# EAGLE design Adafruit PiCowbell CAN Bus (EAGLE 9.6.2)
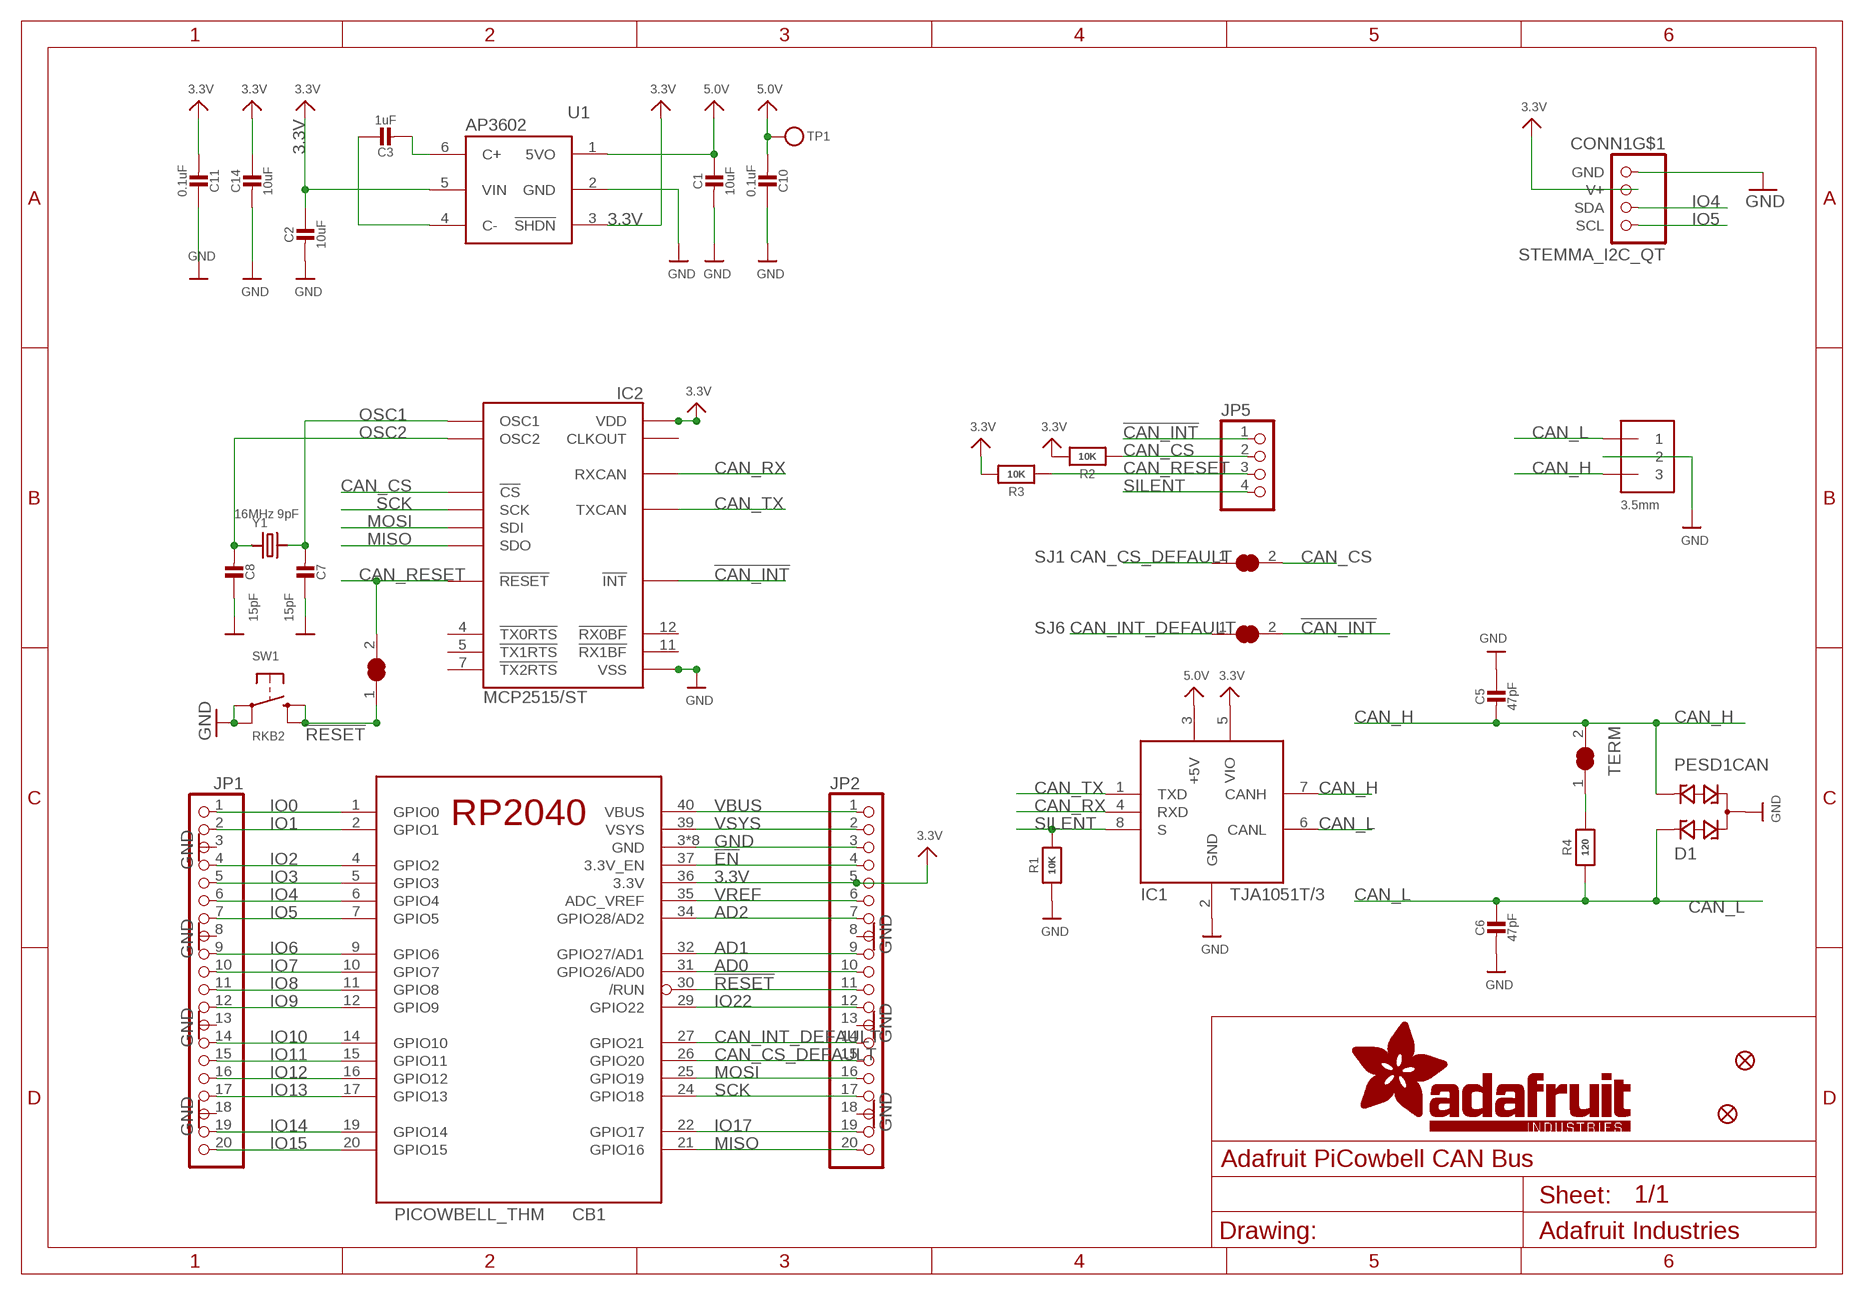
[diagram p0: schematic, sheet 1]

## Parts
C1  10uF  CAP_CERAMIC0805-NOOUTLINE  [0805-NO]
C2  10uF  CAP_CERAMIC0805-NOOUTLINE  [0805-NO]
C3  1uF  CAP_CERAMIC0805-NOOUTLINE  [0805-NO]
C5  47pF  CAP_CERAMIC0603_NO  [0603-NO]
C6  47pF  CAP_CERAMIC0603_NO  [0603-NO]
C7  15pF  CAP_CERAMIC0603_NO  [0603-NO]
C8  15pF  CAP_CERAMIC0603_NO  [0603-NO]
C10  0.1uF  CAP_CERAMIC0603_NO  [0603-NO]
C11  0.1uF  CAP_CERAMIC0603_NO  [0603-NO]
C14  10uF  CAP_CERAMIC0805-NOOUTLINE  [0805-NO]
CAN  3.5mm  TERMBLOCK_1X3  [TERMBLOCK_1X3-3.5MM]
CB1  PICOWBELL_THM  [PICOWBELL_THM]
CONN1  STEMMA_I2C_QT  [JST_SH4]
D1  PESD1CAN  [SOT23]
FID1  FIDUCIAL_1MM  [FIDUCIAL_1MM]
FID2  FIDUCIAL_1MM  [FIDUCIAL_1MM]
IC1  TJA1051T/3  CAN_TRANSCIEVER_TCAN1051V  [SOIC8_150MIL]
IC2  MCP2515/ST  [SSOP20]
JP1  HEADER-1X20_70MIL  [1X20_ROUND_70MIL]
JP2  HEADER-1X20_70MIL  [1X20_ROUND_70MIL]
JP5  HEADER-1X4ROUND  [1X04_ROUND]
R1  10K  RESISTOR_0603_NOOUT  [0603-NO]
R2  10K  RESISTOR_0603_NOOUT  [0603-NO]
R3  10K  RESISTOR_0603_NOOUT  [0603-NO]
R4  120  RESISTOR_0603_NOOUT  [0603-NO]
SJ1  SOLDERJUMPER_CLOSED  [SOLDERJUMPER_CLOSEDWIRE]
SJ5  SOLDERJUMPER_CLOSED  [SOLDERJUMPER_CLOSEDWIRE]
SJ6  SOLDERJUMPER_CLOSED  [SOLDERJUMPER_CLOSEDWIRE]
SW1  RKB2  SWITCH_TACT_SMT_RKB2  [BTN_RKB2_4.6X2.8]
TERM  SOLDERJUMPER_CLOSED  [SOLDERJUMPER_CLOSEDWIRE]
TP1  TESTPOINTROUND1.5MM  [TESTPOINT_ROUND_1.5MM]
U1  AP3602  [SOT23-6]
Y1  16MHz 9pF  CRYSTAL3.2X2.5  [CRYSTAL_3.2X2.5]

## Nets
3.3V: C2.1 C11.2 C14.1 CB1.36(3.3V) CONN1.2(V+) IC1.5(VIO) IC2.20(VDD) JP2.5 R2.2 R3.2 U1.3(!SHDN) U1.5(VIN)
5.0V: C1.1 C10.2 IC1.3(+5V) TP1.P$1 U1.1(5VO)
!CAN_INT: IC2.13(!INT) JP5.1 SJ6.2
!EN: CB1.37(3.3V_EN) JP2.4
!RESET: CB1.30(/RUN) JP2.11 SJ5.1 SW1.B'(S1) SW1.B(S)
AD0: CB1.31(GPIO26/AD0) JP2.10
AD1: CB1.32(GPIO27/AD1) JP2.9
AD2: CB1.34(GPIO28/AD2) JP2.7
CAN_CS: IC2.18(!CS) JP5.2 R2.1 SJ1.2
CAN_CS_DEFAULT: CB1.26(GPIO20) JP2.15 SJ1.1
CAN_H: C5.2 CAN.3 D1.2 IC1.7(CANH) TERM.2
CAN_INT_DEFAULT: CB1.27(GPIO21) JP2.14 SJ6.1
CAN_L: C6.1 CAN.1 D1.1 IC1.6(CANL) R4.1
CAN_RESET: IC2.19(!RESET) JP5.3 R3.1 SJ5.2
CAN_RX: IC1.4(RXD) IC2.2(RXCAN)
CAN_TX: IC1.1(TXD) IC2.1(TXCAN)
GND: C1.2 C2.2 C5.1 C6.2 C7.1 C8.1 C10.1 C11.1 C14.2 CAN.2 CB1.3(GND) CB1.8(GND) CB1.13(GND) CB1.18(GND) CB1.23(GND) CB1.28(GND) CB1.33(GND) CB1.38(GND) CONN1.1(GND) D1.3 IC1.2(GND) IC2.10(VSS) JP1.3 JP1.8 JP1.13 JP1.18 JP2.3 JP2.8 JP2.13 JP2.18 R1.1 SW1.A'(P1) SW1.A(P) U1.2(GND)
IO0: CB1.1(GPIO0) JP1.1
IO1: CB1.2(GPIO1) JP1.2
IO2: CB1.4(GPIO2) JP1.4
IO3: CB1.5(GPIO3) JP1.5
IO4: CB1.6(GPIO4) CONN1.3(SDA) JP1.6
IO5: CB1.7(GPIO5) CONN1.4(SCL) JP1.7
IO6: CB1.9(GPIO6) JP1.9
IO7: CB1.10(GPIO7) JP1.10
IO8: CB1.11(GPIO8) JP1.11
IO9: CB1.12(GPIO9) JP1.12
IO10: CB1.14(GPIO10) JP1.14
IO11: CB1.15(GPIO11) JP1.15
IO12: CB1.16(GPIO12) JP1.16
IO13: CB1.17(GPIO13) JP1.17
IO14: CB1.19(GPIO14) JP1.19
IO15: CB1.20(GPIO15) JP1.20
IO17: CB1.22(GPIO17) JP2.19
IO22: CB1.29(GPIO22) JP2.12
MISO: CB1.21(GPIO16) IC2.17(SDO) JP2.20
MOSI: CB1.25(GPIO19) IC2.16(SDI) JP2.16
N$1: C3.2 U1.6(C+)
N$2: C3.1 U1.4(C-)
N$3: R4.2 TERM.1
OSC1: C7.2 IC2.9(OSC1) Y1.2
OSC2: C8.2 IC2.8(OSC2) Y1.1
SCK: CB1.24(GPIO18) IC2.14(SCK) JP2.17
SILENT: IC1.8(S) JP5.4 R1.2
VBUS: CB1.40(VBUS) JP2.1
VREF: CB1.35(ADC_VREF) JP2.6
VSYS: CB1.39(VSYS) JP2.2
Unconnected: CONN1.MT1(MT) CONN1.MT2(MT) IC2.3(CLKOUT) IC2.4(!TX0RTS) IC2.5(!TX1RTS) IC2.7(!TX2RTS) IC2.11(!RX1BF) IC2.12(!RX0BF)

## Library data of the parts
C1-C3 C5-C8 C10 C11 C14 = microbuilder:CAP_CERAMIC: Ceramic Capacitors For new designs, use the packages preceded by an '_' character since they are more reliable: The following footprints should be used on most boards: _0402 - Standard footprint for regular board layouts _0603 - Standard footprint for regular board layouts _0805 - Standard footprint for regular board layouts _1206 - Standard footprint for regular board layouts For extremely tight-pitch boards where space is at a premium, the following 'micro-pitch' footprints can be used (smaller pads, no silkscreen outline, etc.): _0402MP - Micro-pitch footprint for very dense/compact boards _0603MP - Micro-pitch footprint for very dense/compact boards _0805MP - Micro-pitch footprint for very dense/compact boards _1206MP - Micro-pitch footprint for very dense/compact boards
CAN = adafruit_electromech:TERMBLOCK_1X3: 3.5mm Terminal block http://www.ladyada.net/library/pcb/eaglelibrary.html
CB1 = adafruit_micro:PICOWBELL
CONN1 = adafruit_electromech:STEMMA_I2C; LCSC: C2845363
D1 = diode:PESD1CAN: CAN bus ESD protection diode Source: http://www.nxp.com/documents/data_sheet/PESD1CAN.pdf
FID1 FID2 = microbuilder:FIDUCIAL: Fiducial Alignment Points Various fiducial points for machine vision alignment.; BOM: EXCLUDE
IC1 = microbuilder:CAN_TRANSCIEVER
IC2 = microbuilder:MCP2515
JP1 JP2 = adafruit_electromech:HEADER-1X20
JP5 = microbuilder:HEADER-1X4: PIN HEADER
R1-R4 = microbuilder:RESISTOR: Resistors For new designs, use the packages preceded by an '_' character since they are more reliable: The following footprints should be used on most boards: _0402 - Standard footprint for regular board layouts _0603 - Standard footprint for regular board layouts _0805 - Standard footprint for regular board layouts _1206 - Standard footprint for regular board layouts For extremely tight-pitch boards where space is at a premium, the following 'micro-pitch' footprints can be used (smaller pads, no silkscreen outline, etc.): _0402MP - Micro-pitch footprint for very dense/compact boards _0603MP - Micro-pitch footprint for very dense/compact boards _0805MP - Micro-pitch footprint for very dense/compact boards _1206MP - Micro-pitch footprint for very dense/compact boards
SJ1 SJ5 SJ6 TERM = microbuilder:SOLDERJUMPER_CLOSED: Solder Jumper - Closed These solder jumpers are closed by default CLOSEDWIRE - 10 mil trace between pads that can be cut and resoldered later CLOSEDPERM - 63 mil trace between pads for a permanent connection (used to 'bridge' two signals, a shameless hack for Eagle). Can double as a test point as well (no cream layer)
SW1 = adafruit_electromech:SWITCH_TACT_SMT: SMT Tact Switches RKB2 https://www.digikey.com/short/m027prz5
TP1 = microbuilder:TESTPOINT: Test Point Various test points for characterisation and PCB testing TESTPOINT_SMT - Compact Surface Mount Test Point [Digikey: 5016KTR-ND]
U1 = microbuilder:AP3602
Y1 = microbuilder:CRYSTAL: Crystals HC49UP - Surface Mount Crystal 4.0MHz 18pF +/-30ppm Surface Mount Crystal [Digikey: 535-9857-1-ND] 12.0 MHz Surface Mount Crystal [Digikey: 535-9869-6-ND] 25.0 MHz Surface Mount Crystal [Digikey: 535-9078-1-ND] 2.5 x 2.0mm - MEMs SMT Crystal 16.0 MHz 10pF 20ppm 2.5 x 2.0mm Crystal [Digikey -40-85°C: 535-10923-1-ND] 3.2 x 2.5mm - MEMs SMT Crystal 12.0 MHz 8pF 15ppm 3.2 x 2.5mm Crystal [Digikey: -10-70°C: 644-1047-1-ND -40-125°C: 644-1128-1-ND] 40~85°C cheaper: 644-1173-6-ND 16.0 MHz 8pF 15ppm 3.2 x 2.5mm Crystal [Digikey: -10-70°C: 644-1049-1-ND -40-125°C: 644-1129-2-ND]-40~85°C cheaper: 644-1175-6-ND 16.0 MHz 10pF 10ppm 3.2 x 2.5mm Crystal [Digikey: 644-1100-1-ND] 27.12 MHz 18pF 30ppm 3.2 x 2.5mm Crystal [Digikey: 887-1424-1-ND] 27.12MHz 10pF 10ppm 3.2 x 2.5mm Crystal [Digikey: 887-1329-1-ND] 4.9 x 1.8mm - MEMs SMT Crystal 32.768 KHz 12.5pF 20ppm 4.9 x 1.8mm Crystal [Digikey: SE2415CT-ND] 8.0 x 3.8mm - Surface Mount Crystal 32.768kHz 12.5pF 20ppm -40°C-85°C [Digikey: 535-9166-2-ND] Cylinder 32.768KHz Cylinder Crystal (2x6mm body) [Ex. Digikey: 300-8341-2-ND]

## Board
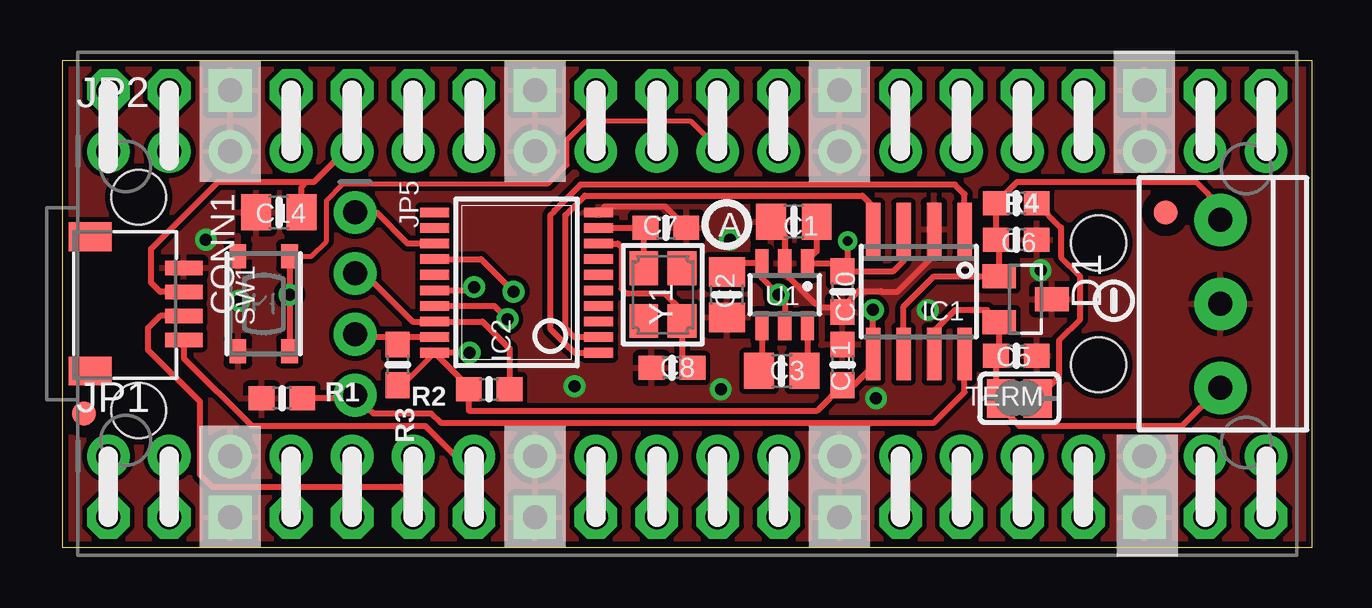
[diagram p1: board, top side]
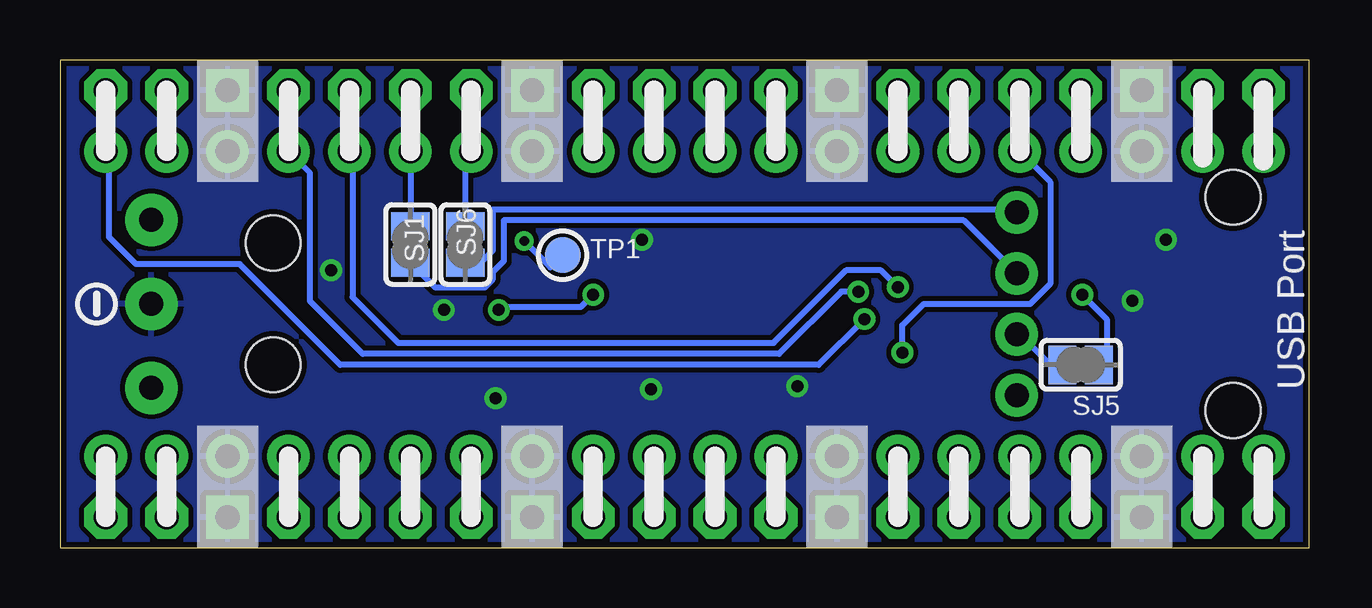
[diagram p2: board, bottom side, seen from below]

Size 52.07 x 20.32 mm. Coordinates in mm from the lower left corner, seen from the top.
Outline: 0,0 0,20.32 52.07,20.32 52.07,0 0,0
Copper layers (1*16): Top 0.035mm / dielectric 1.5mm / Bottom 0.035mm
Design rules "adafruit": minimum track width 8mil, minimum drill 15.5mil, track to track 8mil, track to pad 8mil, pad to pad 8mil, via to via 8mil, smd to smd 8mil, copper to edge 10mil, drill to drill 8mil, minimum pad ring 10mil, minimum via ring 8mil, stop-mask expansion 2mil, vias tented up to drill 20mil, thermal gap 10mil
Holes 2.29 mm at 3.17,14.61 3.17,5.71 43.18,12.7 43.18,7.62

### Footprints (pad centres in the part's own frame; a part is rotated, then mirrored left to right if it is on the bottom)
0805-NO = smd 1.24 x 1.5: 1 -0.95,0; 2 0.95,0
0603-NO = smd 1.075 x 1: 1 -0.85,0; 2 0.85,0
TERMBLOCK_1X3-3.5MM = drill 1 pad 2.184: 1 3.5,0; 2 0,0; 3 -3.5,0
PICOWBELL_THM = drill 1 pad 1.778 octagon: 1 1.27,0; 2 3.81,0; 4 8.89,0; 5 11.43,0; 6 13.97,0; 7 16.51,0; 9 21.59,0; 10 24.13,0; 11 26.67,0; 12 29.21,0; 14 34.29,0; 15 36.83,0; 16 39.37,0; 17 41.91,0; 19 46.99,0; 20 49.53,0; 21 49.53,17.78; 22 46.99,17.78; 24 41.91,17.78; 25 39.37,17.78; 26 36.83,17.78; 27 34.29,17.78; 29 29.21,17.78; 30 26.67,17.78; 31 24.13,17.78; 32 21.59,17.78; 34 16.51,17.78; 35 13.97,17.78; 36 11.43,17.78; 37 8.89,17.78; 39 3.81,17.78; 40 1.27,17.78 | drill 1 pad 1.778 square: 3 6.35,0; 8 19.05,0; 13 31.75,0; 18 44.45,0; 23 44.45,17.78; 28 31.75,17.78; 33 19.05,17.78; 38 6.35,17.78
JST_SH4 = smd 0.6 x 1.55: 1 -1.5,2.006; 2 -0.5,2.006; 3 0.5,2.006; 4 1.5,2.006 | smd 1.2 x 1.8: MT1 -2.8,-1.894; MT2 2.8,-1.894
SOT23 = smd 1 x 1.4: 1 -0.95,-1.1; 2 0.95,-1.1; 3 0,1.1
FIDUCIAL_1MM = smd 1 x 1: 1 0,0
SOIC8_150MIL = smd 0.6 x 2.2: 1 -1.905,-2.6; 2 -0.635,-2.6; 3 0.635,-2.6; 4 1.905,-2.6; 5 1.905,2.6; 6 0.635,2.6; 7 -0.635,2.6; 8 -1.905,2.6
SSOP20 = smd 0.4 x 1.2: 1 -2.925,-3.42; 2 -2.275,-3.42; 3 -1.625,-3.42; 4 -0.975,-3.42; 5 -0.325,-3.42; 6 0.325,-3.42; 7 0.975,-3.42; 8 1.625,-3.42; 9 2.275,-3.42; 10 2.925,-3.42; 11 2.925,3.42; 12 2.275,3.42; 13 1.625,3.42; 14 0.975,3.42; 15 0.325,3.42; 16 -0.325,3.42; 17 -0.975,3.42; 18 -1.625,3.42; 19 -2.275,3.42; 20 -2.925,3.42
1X20_ROUND_70MIL = drill 1 pad 1.778: 1 -24.13,0; 2 -21.59,0; 3 -19.05,0; 4 -16.51,0; 5 -13.97,0; 6 -11.43,0; 7 -8.89,0; 8 -6.35,0; 9 -3.81,0; 10 -1.27,0; 11 1.27,0; 12 3.81,0; 13 6.35,0; 14 8.89,0; 15 11.43,0; 16 13.97,0; 17 16.51,0; 18 19.05,0; 19 21.59,0; 20 24.13,0
1X04_ROUND = drill 1 pad 1.778: 1 -3.81,0; 2 -1.27,0; 3 1.27,0; 4 3.81,0
SOLDERJUMPER_CLOSEDWIRE = smd 1.168 x 1.6: 1 -0.762,0; 2 0.762,0 | smd 0.635 x 0.203: WIRE 0,0
BTN_RKB2_4.6X2.8 = smd 1 x 0.7: A 1.973,1.075; A' -1.973,1.075; B 1.973,-1.075; B' -1.973,-1.075
TESTPOINT_ROUND_1.5MM = smd 1.5 x 1.5: P$1 0,0
SOT23-6 = smd 0.55 x 1.2: 1 -0.95,-1.3; 2 0,-1.3; 3 0.95,-1.3; 4 0.95,1.3; 5 0,1.3; 6 -0.95,1.3
CRYSTAL_3.2X2.5 = smd 1.4 x 1.2: 1 -1.1,-0.8; 2 1.1,0.8; GND1 -1.1,0.8; GND2 1.1,-0.8

### Placement (x,y rotation side)
C1  30.48,13.59 180 top
C2  27.69,10.54 270 top
C3  29.97,7.37 0 top
C5  39.75,8 180 top
C6  39.75,12.83 0 top
C7  25.15,13.33 180 top
C8  25.4,7.49 0 top
C10  32.51,10.67 90 top
C11  32.51,7.62 270 top
C14  9.02,13.97 180 top
CAN  48.26,10.16 90 top
CB1  0.64,1.27 0 top
CONN1  3.05,10.16 270 top
D1  40.13,10.35 270 top
FID1  0.89,5.59 0 top
FID2  45.97,13.97 0 top
IC1  35.69,10.67 180 top
IC2  18.92,11.05 90 top
JP1  26.04,3.81 0 top
JP2  26.04,16.51 0 top
JP5  12.19,10.16 270 top
PLABEL36  [PLABEL36]  4.83,5.46 0 bottom
PLABEL37  [PLABEL37]  1.14,5.33 0 bottom
PLABEL38  [PLABEL38]  9.53,5.4 0 bottom
PLABEL40  [PLABEL40]  14.73,5.46 0 bottom
PLABEL41  [PLABEL41]  17.14,5.46 0 bottom
PLABEL42  [PLABEL42]  22.23,5.46 0 bottom
PLABEL43  [PLABEL43]  24.64,5.46 0 bottom
PLABEL44  [PLABEL44]  27.3,5.46 0 bottom
PLABEL45  [PLABEL45]  29.72,5.46 0 bottom
PLABEL46  [PLABEL46]  1.14,14.61 90 bottom
PLABEL47  [PLABEL47]  5.08,14.61 90 bottom
PLABEL49  [PLABEL49]  27.3,14.99 0 bottom
PLABEL50  [PLABEL50]  50.16,5.27 0 bottom
PLABEL51  [PLABEL51]  47.43,5.21 0 bottom
PLABEL52  [PLABEL52]  50.16,14.99 0 bottom
PLABEL53  [PLABEL53]  47.37,15.05 0 bottom
PLABEL54  [PLABEL54]  29.84,14.99 0 bottom
PLABEL55  [PLABEL55]  37.47,14.99 0 bottom
PLABEL56  [PLABEL56]  42.42,14.99 0 bottom
PLABEL57  [PLABEL57]  37.47,5.33 0 bottom
PLABEL58  [PLABEL58]  42.55,5.33 0 bottom
PLABEL59  [PLABEL59]  39.88,14.99 0 bottom
PLABEL60  [PLABEL60]  40.01,5.33 0 bottom
PLABEL61  [PLABEL61]  24.77,14.99 0 bottom
PLABEL62  [PLABEL62]  17.14,14.86 0 bottom
PLABEL63  [PLABEL63]  14.61,14.86 0 bottom
PLABEL64  [PLABEL64]  13.97,13.97 90 top
PLABEL65  [PLABEL65]  13.84,11.3 90 top
PLABEL66  [PLABEL66]  10.67,8.76 90 top
PLABEL67  [PLABEL67]  14.86,5.46 0 top
PLABEL68  [PLABEL68]  43.69,5.59 90 top
PLABEL69  [PLABEL69]  43.69,14.61 90 top
PLABEL70  [PLABEL70]  36.45,6.22 0 top
PLABEL71  [PLABEL71]  5.97,14.1 0 top
PLABEL72  [PLABEL72]  6.1,6.22 0 top
PLABEL73  [PLABEL73]  23.75,6.1 0 top
PLABEL74  [PLABEL74]  34.92,14.99 0 bottom
PLABEL75  [PLABEL75]  34.92,5.46 0 bottom
PLABEL76  [PLABEL76]  22.23,14.99 0 bottom
PLABEL77  [PLABEL77]  9.4,14.86 0 bottom
PLABEL78  [PLABEL78]  39.37,12.7 90 bottom
PLABEL79  [PLABEL79]  33.15,12.32 90 bottom
PLABEL80  [PLABEL80]  29.84,12.45 0 bottom
PLABEL81  [PLABEL81]  50.55,13.46 90 bottom
PLABEL82  [PLABEL82]  50.42,6.86 90 bottom
PLABEL83  [PLABEL83]  45.72,10.03 90 bottom
PLABEL84  [PLABEL84]  27.56,8.51 0 bottom
PLABEL85  [PLABEL85]  5.46,10.22 90 bottom
R1  9.14,6.22 0 top
R2  17.78,6.6 180 top
R3  13.97,7.62 270 top
R4  39.75,14.35 0 top
SJ1  37.47,12.64 270 bottom
SJ5  9.53,7.62 180 bottom
SJ6  35.18,12.64 270 bottom
SW1  8.38,10.16 90 top
TERM  39.88,6.22 180 top
TP1  31.11,12.19 0 bottom
U1  30.1,10.54 180 top
U$2  [SYMBOL_MINUS]  50.55,10.16 270 bottom
U$11  [PCBFEAT-REV-040]  27.69,13.46 0 top
U$34  [SYMBOL_MINUS]  43.81,10.29 90 top
Y1  25.02,10.54 90 top

### Tracks (layer width: path | path; a pad name or v marks a point on that pad's centre or on a via)
3.3V  (via drill 0.5)
  Top 0.203: IC2.20 14.15,6.77 R3.2
  Top 0.254: U1.5 30.1,10.29 v29.84,10.54 29.72,10.67 29.15,11.24 U1.3 28.04,11.84 C2.1 | v33.78,9.91 IC1.5 33.78,7.56 32.99,6.77 C11.2 31.46,5.71 16.93,5.71 R2.2 16.93,6.7 IC2.20 v16.96,8.13 | JP2.5 11.74,16.51 10.47,15.24 10.16,15.24 | CONN1.2 4.07,10.66 3.68,11.05 3.68,12.45 6.48,15.24 10.16,15.24 | C14.1 9.97,15.05 10.16,15.24
  Bottom 0.254: CB1.36 JP2.5 10.79,15.24 10.79,10.99 11.62,10.16 16.07,10.16 16.96,9.27 v16.96,8.13 | v33.78,9.91 33.66,10.03 30.35,10.03 v29.84,10.54
5.0V  (via drill 0.39)
  Top 0.254: C1.1 31.43,12.35 31.05,11.97 U1.1 32.19,11.84 C10.2 | IC1.3 35.05,11.94 34.63,11.52 C10.2 | C10.2 32.72,11.73 v32.72,12.78
  Bottom 0.254: v32.72,12.78 31.62,11.68 TP1.P$1
!CAN_INT
  Top 0.254: IC2.13 14.38,12.67 13.08,13.97 JP5.1
  Bottom 0.254: SJ6.2 34.54,11.87 34.04,12.38 34.04,14.1 12.32,14.1 JP5.1
!EN
  Bottom 0.254: CB1.37 JP2.4
!RESET  (via drill 0.5)
  Top 0.203: SW1.B 10.36,12.13 11,12.78 11,14.46 11.7,15.16 20.24,15.16 21.03,15.95 21.03,17 21.81,17.78 26.16,17.78 27.3,16.64 JP2.11
  Top 0.254: SW1.B v9.46,10.54 SW1.B'
  Bottom 0.254: CB1.30 JP2.11 | v9.46,10.54 8.44,9.53 8.44,7.94 SJ5.1
AD0
  Bottom 0.254: JP2.10 CB1.31
AD1
  Bottom 0.254: CB1.32 JP2.9
AD2
  Bottom 0.254: JP2.7 CB1.34
CAN_CS
  Top 0.254: JP5.2 12.57,11.43 14.58,9.42 IC2.18 17.5,9.42 18.63,8.29 R2.1
  Bottom 0.254: JP5.2 14.4,13.64 33.58,13.64 33.58,11.94 34.05,11.47 34.05,11.15 34.37,10.83 36.42,10.83 SJ1.2
CAN_CS_DEFAULT
  Bottom 0.254: CB1.26 JP2.15 SJ1.1
CAN_H
  Top 0.254: IC1.7 36.32,9.02 37.21,9.91 38.53,9.91 D1.2 39.03,8.13 C5.2 38.9,6.44 TERM.2 39.12,5.84 39.88,5.08 46.68,5.08 CAN.3
CAN_INT_DEFAULT
  Bottom 0.254: CB1.27 JP2.14 35.18,16.26 SJ6.1
CAN_L
  Top 0.254: IC1.6 35.05,10.03 36.32,11.3 D1.1 39.03,12.7 C6.1 R4.1 39.79,15.24 47.24,15.24 48.26,14.22 CAN.1
CAN_RESET
  Top 0.203: R3.1 13.97,8.52 14.22,8.77
  Top 0.254: IC2.19 14.22,8.77 12.31,8.77 JP5.3
  Bottom 0.254: SJ5.2 10.79,7.62 12.06,8.89 JP5.3
CAN_RX
  Top 0.254: IC2.2 21.32,8.77 20.95,9.14 20.95,13.85 21.77,14.67 33.34,14.67 33.78,14.22 IC1.4
CAN_TX
  Top 0.254: IC1.1 37.59,14.73 37.2,15.13 21.58,15.13 20.5,14.04 20.5,14.02 20.32,13.84 20.32,9.13 21.14,8.32 21.15,8.32 21.34,8.12 IC2.1
GND  (via drill 0.5)
  Top 0.254: C7.1 25.12,14.21 22.58,14.21 IC2.10 | C1.2 30.1,13.02 U1.2 30.1,11.43 31.36,10.17 31.46,10.17 31.61,10.02 32.5,10.02 33.17,10.69 34.11,10.69 34.13,10.67 34.8,10.67 36.32,12.19 IC1.2
  other vias: 33.91,6.22 27.43,6.6 21.34,6.73 5.97,12.83 7.37,10.29 40.77,11.56 36.07,9.91 27.81,12.83
  pour Bottom: 0,20.32 52.07,20.32 52.07,0 0,0
  pour Top: 0,20.32 52.07,20.32 52.07,0 0,0
IO0
  Bottom 0.254: JP1.1 CB1.1
IO1
  Bottom 0.254: JP1.2 CB1.2
IO2
  Bottom 0.254: CB1.4 JP1.4
IO3
  Bottom 0.254: JP1.5 CB1.5
IO4
  Top 0.254: CONN1.3 4.07,9.66 3.56,9.14 3.56,8.26 5.71,6.1 5.71,3.05 6.22,2.54 14.1,2.54 14.61,2.03 CB1.6
  Bottom 0.254: CB1.6 JP1.6
IO5
  Top 0.254: CONN1.4 5.05,7.9 7.87,5.08 15.11,5.08 16.38,3.81 JP1.7
  Bottom 0.254: JP1.7 CB1.7
IO6
  Bottom 0.254: CB1.9 JP1.9
IO7
  Bottom 0.254: JP1.10 CB1.10
IO8
  Bottom 0.254: CB1.11 JP1.11
IO9
  Bottom 0.254: JP1.12 CB1.12
IO10
  Bottom 0.254: CB1.14 JP1.14
IO11
  Bottom 0.254: JP1.15 CB1.15
IO12
  Bottom 0.254: CB1.16 JP1.16
IO13
  Bottom 0.254: JP1.17 CB1.17
IO14
  Bottom 0.254: CB1.19 JP1.19
IO15
  Bottom 0.254: CB1.20 JP1.20
IO17
  Bottom 0.254: CB1.22 JP2.19
IO22
  Bottom 0.254: JP2.12 CB1.29
MISO  (via drill 0.5)
  Top 0.254: IC2.17 17.99,10.07 v18.54,9.53
  Bottom 0.254: CB1.21 JP2.20 50.04,16.38 50.04,12.95 48.9,11.81 44.58,11.81 40.39,7.62 20.45,7.62 v18.54,9.53
MOSI  (via drill 0.5)
  Top 0.254: IC2.16 17.01,10.72 v17.14,10.86
  Bottom 0.254: CB1.25 JP2.16 39.88,16.38 39.88,10.44 37.97,8.53 22.33,8.53 19.3,11.56 17.84,11.56 v17.14,10.86
N$1
  Top 0.254: U1.6 31.05,7.49 C3.2
N$2
  Top 0.254: U1.4 29.15,7.82 29.08,7.81 29.02,7.67 C3.1
N$3
  Top 0.254: R4.2 41.62,13.33 41.62,12.1 42.42,11.3 42.42,9.53 41.53,8.64 41.53,7.11 TERM.1
OSC1
  Top 0.254: Y1.2 24.22,13.26 C7.2 22.35,13.33 IC2.9
OSC2
  Top 0.254: C8.2 25.82,7.92 Y1.1 25.82,9.87 25.08,10.61 23.48,10.61 23.29,10.8 23.29,12.53 23.14,12.67 IC2.8
SCK  (via drill 0.5)
  Top 0.254: IC2.14 17.44,12.02 v18.8,10.67
  Bottom 0.254: CB1.24 JP2.17 41.66,15.62 41.66,10.29 39.45,8.08 22.1,8.08 19.51,10.67 v18.8,10.67
SILENT
  Top 0.254: R1.2 12.06,6.22 JP5.4 12.95,5.59 15.37,5.59 15.75,5.21 36.32,5.21 37.59,6.48 IC1.8
VBUS
  Bottom 0.254: CB1.40 JP2.1
VREF
  Bottom 0.254: CB1.35 JP2.6
VSYS
  Bottom 0.254: JP2.2 CB1.39

### Text on the board
bPlace: USB Port
Pinguin_tBackup: I2C | INT | L | CS | RST | QT | MCP2515 | Term | SLNT | H
Pinguin_bBackup: EN | A1 | 21 | L | Pins: SCK 18,MOSI 19 / MISO 16,CS 20,INT 21 | INT | CS | CAN Out | Adafruit CAN PiCowBell | H | 10